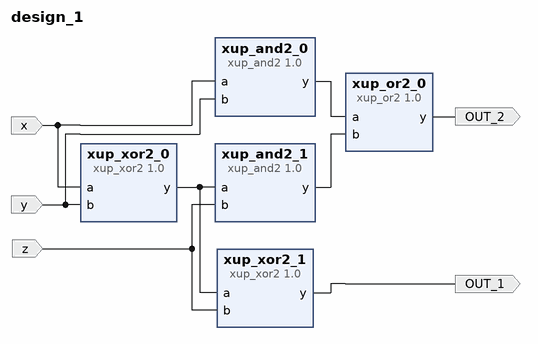
[diagram p0: block diagram of the top level]
# Vivado block design design_1, xc7a35tcpg236-1, Vivado 2023.2
create_bd_design design_1

create_bd_port -dir I x
create_bd_port -dir I y
create_bd_port -dir I z
create_bd_port -dir O OUT_2
create_bd_port -dir O OUT_1

create_bd_cell -type ip -vlnv xilinx.com:xup:xup_xor2:1.0 xup_xor2_0
create_bd_cell -type ip -vlnv xilinx.com:xup:xup_and2:1.0 xup_and2_0
create_bd_cell -type ip -vlnv xilinx.com:xup:xup_xor2:1.0 xup_xor2_1
create_bd_cell -type ip -vlnv xilinx.com:xup:xup_and2:1.0 xup_and2_1
create_bd_cell -type ip -vlnv xilinx.com:xup:xup_or2:1.0 xup_or2_0

# ---- connections ----

connect_bd_net [get_bd_ports x] [get_bd_pins xup_xor2_0/a] [get_bd_pins xup_and2_0/a]
connect_bd_net [get_bd_pins xup_and2_0/y] [get_bd_pins xup_or2_0/a]
connect_bd_net [get_bd_pins xup_and2_1/y] [get_bd_pins xup_or2_0/b]
connect_bd_net [get_bd_pins xup_or2_0/y] [get_bd_ports OUT_2]
connect_bd_net [get_bd_pins xup_xor2_0/y] [get_bd_pins xup_xor2_1/a] [get_bd_pins xup_and2_1/a]
connect_bd_net [get_bd_pins xup_xor2_1/y] [get_bd_ports OUT_1]
connect_bd_net [get_bd_ports y] [get_bd_pins xup_xor2_0/b] [get_bd_pins xup_and2_0/b]
connect_bd_net [get_bd_ports z] [get_bd_pins xup_xor2_1/b] [get_bd_pins xup_and2_1/b]

validate_bd_design
save_bd_design
